# Altium schematic sheet StepDrive.SchDoc
size A4; Organization: Altium Limited; Address1: L3, 12a Rodborough Rd; Address2: Frenchs Forest; Address3: NSW; Address4: Australia 2086
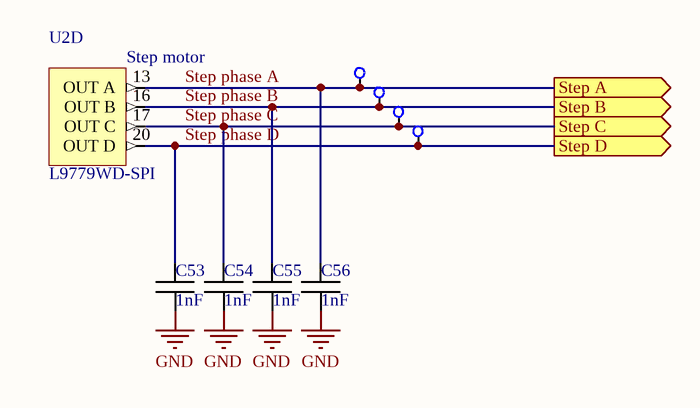
[diagram p0: StepDrive.SchDoc]

## Parts
C53  1nF  [SMD 0603]
C54  1nF  [SMD 0603]
C55  1nF  [SMD 0603]
C56  1nF  [SMD 0603]
TP34  TestPoint  [TESTPOINT]  (value not drawn)
TP35  TestPoint  [TESTPOINT]  (value not drawn)
TP36  TestPoint  [TESTPOINT]  (value not drawn)
TP37  TestPoint  [TESTPOINT]  (value not drawn)
U2  L9779WD-SPI  [HiQUAD-64]  (part D of 6)

## Ports
Step A (out), Step B (out), Step C (out), Step D (out)

## Nets
GND: C53.1 C54.1 C55.1 C56.1
Step phase A: C56.2 TP34.0 U2.13(OUT_A) ; port Step A
Step phase B: C55.2 TP35.0 U2.16(OUT_B) ; port Step B
Step phase C: C54.2 TP36.0 U2.17(OUT_C) ; port Step C
Step phase D: C53.2 TP37.0 U2.20(OUT_D) ; port Step D

## Notes on the sheet
- Title
- Size:
- Date:
- A4
- Number:
- Time:
- Revision:
- Sheet
- of
- File:
- (in symbol L9779WD-SPI, part D) Step motor

## Library data of the parts
C53-C56 = Capasitor: CC0603KRX7R9BB102; Value: 1nF
U2 = L9779WD-SPI: Multifunction IC for engine management system